# EAGLE schematic Calliope mini rev2.1 (EAGLE 9.6.2)
Assembly variants: -1

## Sheet 1 of 2
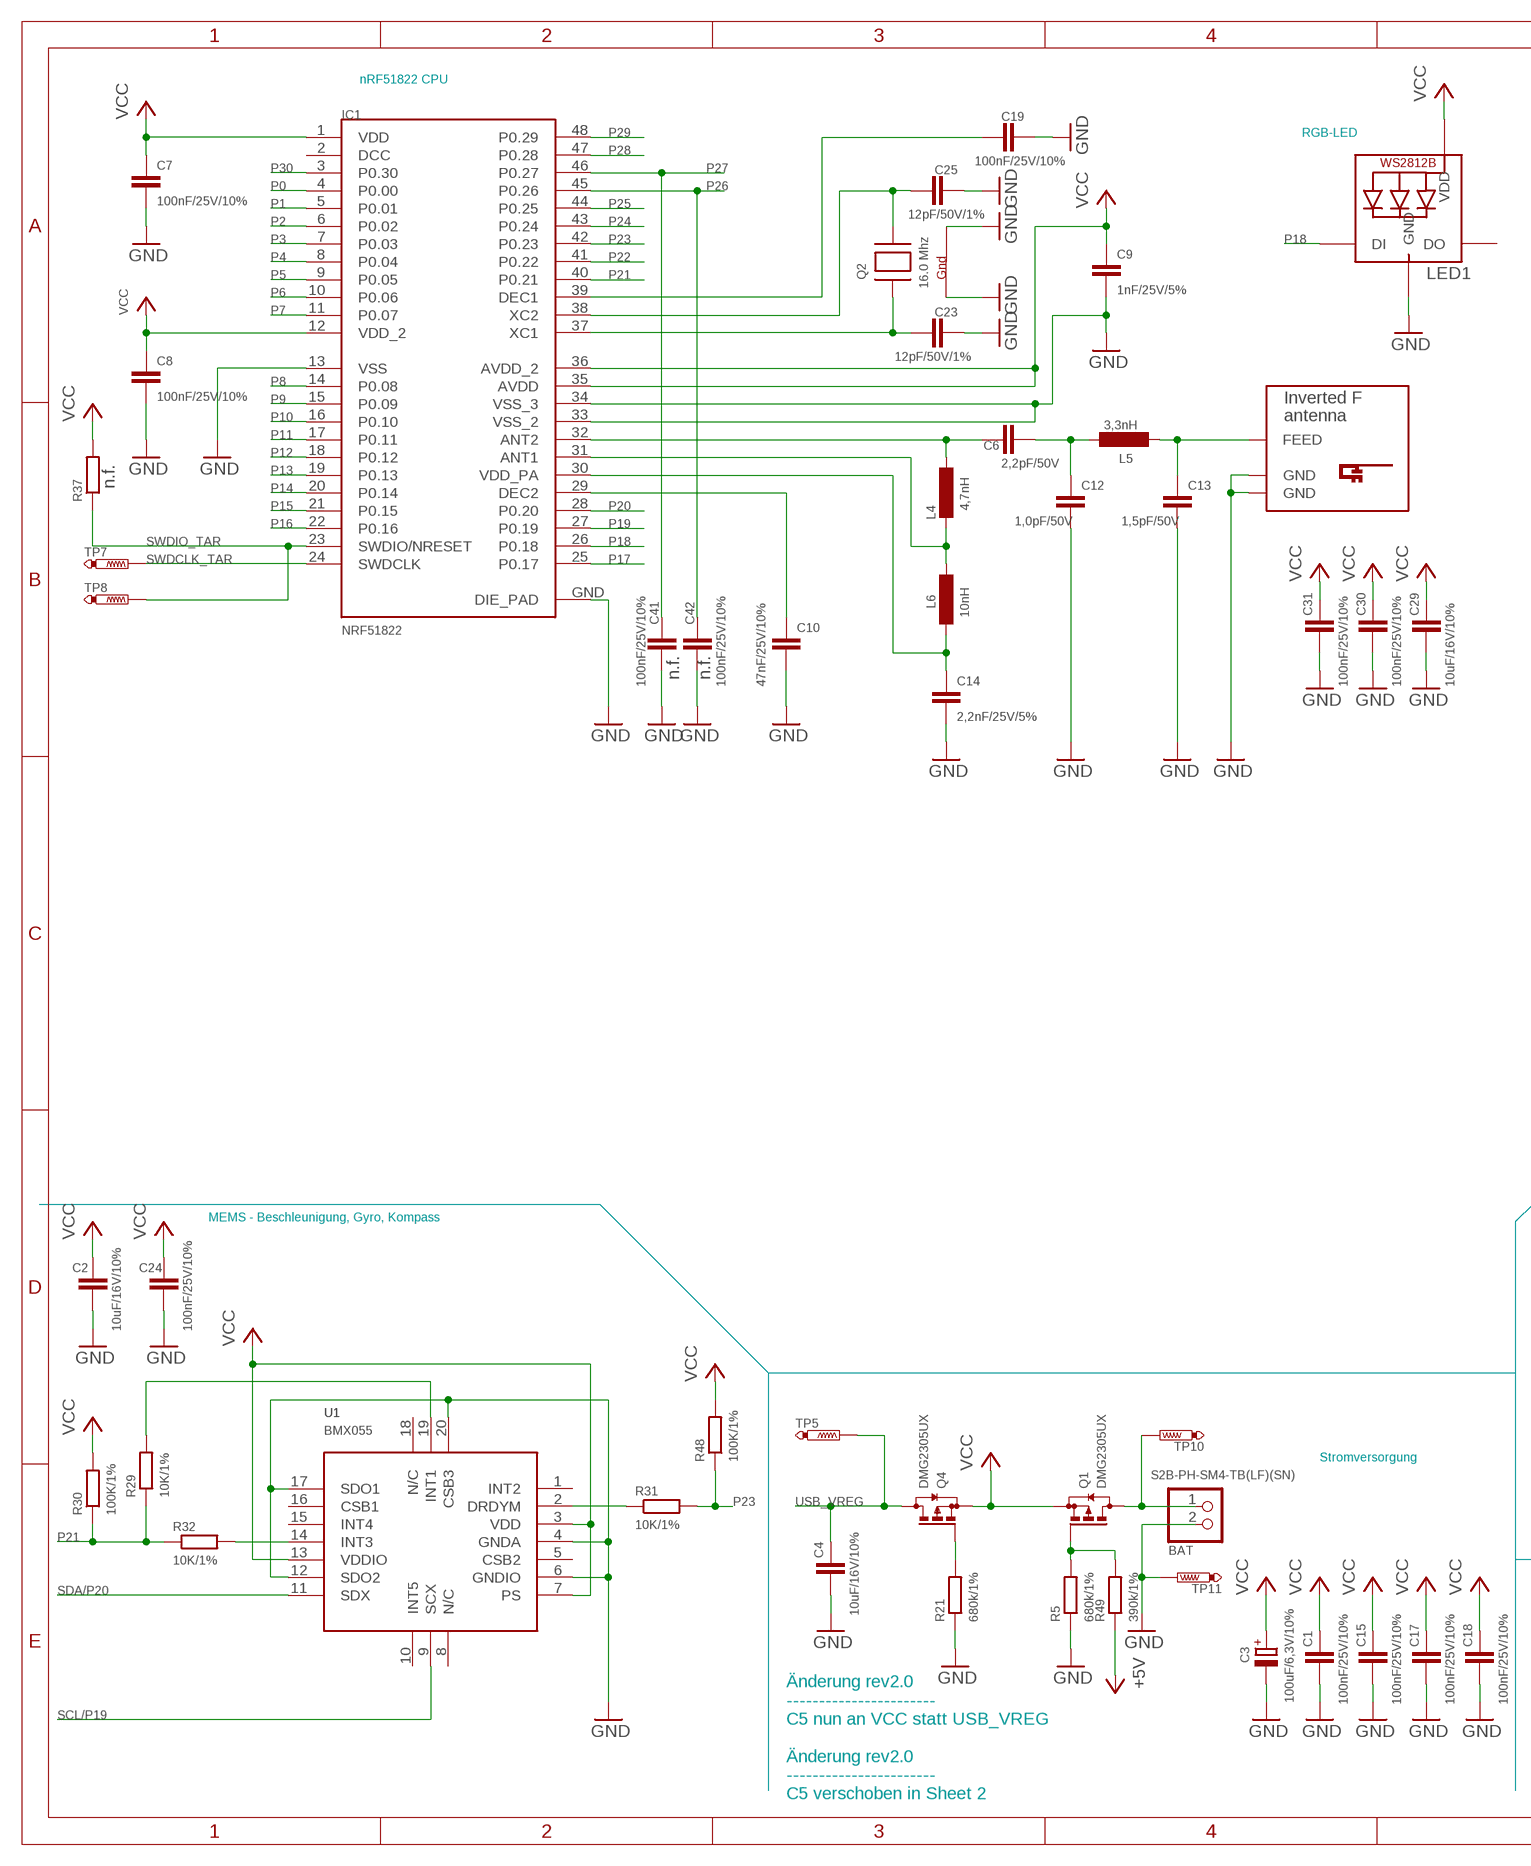
[diagram p0: schematic, sheet 1, part 1 of 2]
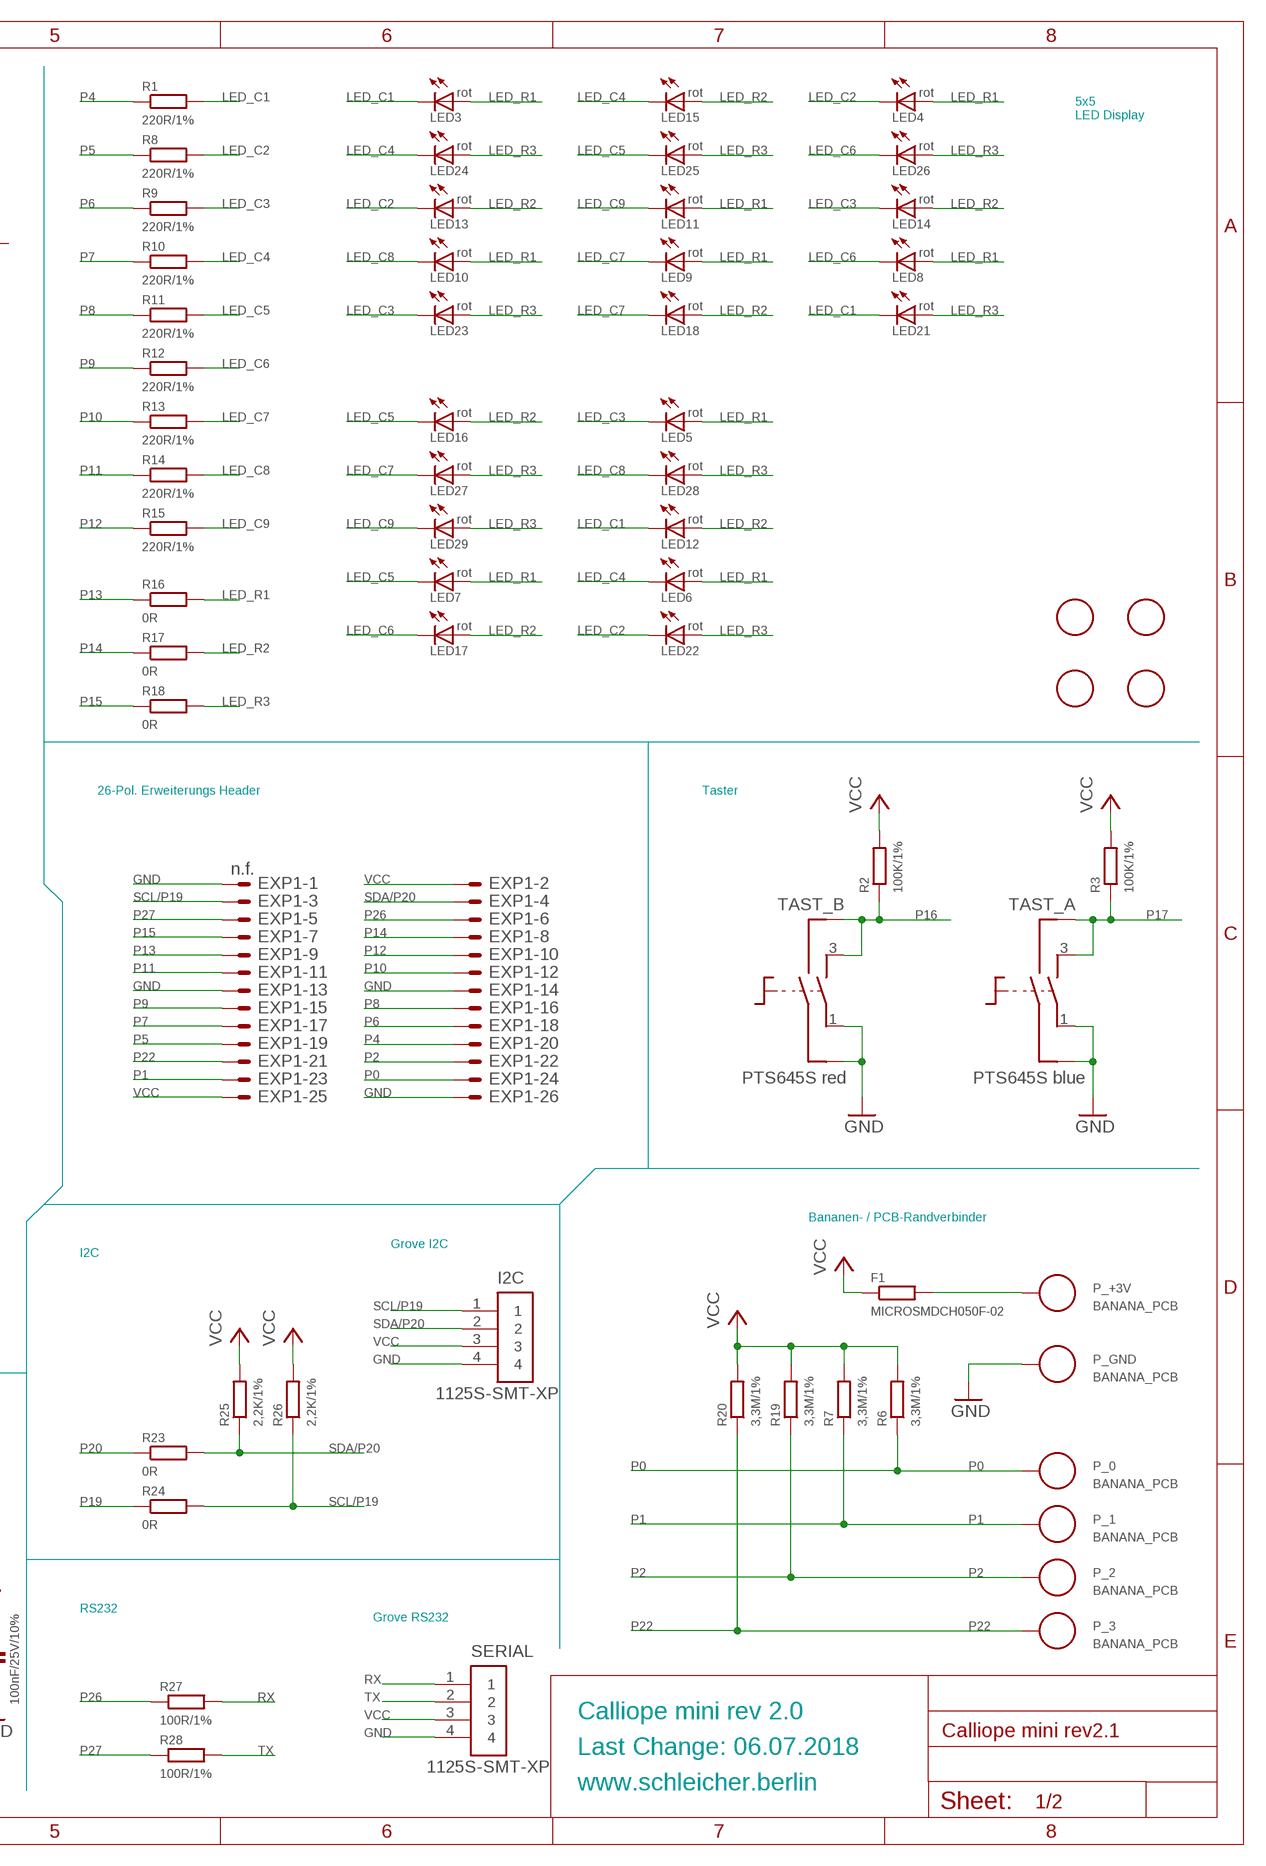
[diagram p1: schematic, sheet 1, part 2 of 2]

### Parts
BAT  S2B-PH-SM4-TB(LF)(SN)  JST_2PIN-SMT-RA  [JST-PH-2-SMT-RA]
C1  100nF/25V/10%  C-EU0402  [0402]
C2  10uF/16V/10%  C-EU0402  [0402]
C3  100uF/6,3V/10%  CPOL-EUD/7343-31R  [D/7343-31R]
C4  10uF/16V/10%  C-EU0402  [0402]
C6  2,2pF/50V  C-EU0402  [0402]
C7  100nF/25V/10%  C-EU0402  [0402]
C8  100nF/25V/10%  C-EU0402  [0402]
C9  1nF/25V/5%  C-EU0402  [0402]
C10  47nF/25V/10%  C-EU0402  [0402]
C12  1,0pF/50V  C-EU0402  [0402]
C13  1,5pF/50V  C-EU0402  [0402]
C14  2,2nF/25V/5%  C-EU0402  [0402]
C15  100nF/25V/10%  C-EU0402  [0402]
C17  100nF/25V/10%  C-EU0402  [0402]
C18  100nF/25V/10%  C-EU0402  [0402]
C19  100nF/25V/10%  C-EU0402  [0402]
C23  12pF/50V/1%  C-EU0402  [0402]
C24  100nF/25V/10%  C-EU0402  [0402]
C25  12pF/50V/1%  C-EU0402  [0402]
C29  10uF/16V/10%  C-EU0402  [0402]
C30  100nF/25V/10%  C-EU0402  [0402]
C31  100nF/25V/10%  C-EU0402  [0402]
C41  100nF/25V/10%  C-EU0402  [0402]  (not fitted in variant -1)
C42  100nF/25V/10%  C-EU0402  [0402]  (not fitted in variant -1)
EXP1  ML26E  [ML26]  (not fitted in variant -1)
F1  MICROSMDCH050F-02  R-EU_R1210  [R1210]
I2C  1125S-SMT-XP  [1125S-SMT-XP]
IC1  NRF51822  [QFN48]
L4  4,7nH  L-EU0402  [0402]
L5  3,3nH  L-EU0402  [0402]
L6  10nH  L-EU0402  [0402]
LED1  SK6812MINI  WS2812B3535  [LED3535]
LED3  rot  LEDCHIPLED_0603  [CHIPLED_0603]
LED4  rot  LEDCHIPLED_0603  [CHIPLED_0603]
LED5  rot  LEDCHIPLED_0603  [CHIPLED_0603]
LED6  rot  LEDCHIPLED_0603  [CHIPLED_0603]
LED7  rot  LEDCHIPLED_0603  [CHIPLED_0603]
LED8  rot  LEDCHIPLED_0603  [CHIPLED_0603]
LED9  rot  LEDCHIPLED_0603  [CHIPLED_0603]
LED10  rot  LEDCHIPLED_0603  [CHIPLED_0603]
LED11  rot  LEDCHIPLED_0603  [CHIPLED_0603]
LED12  rot  LEDCHIPLED_0603  [CHIPLED_0603]
LED13  rot  LEDCHIPLED_0603  [CHIPLED_0603]
LED14  rot  LEDCHIPLED_0603  [CHIPLED_0603]
LED15  rot  LEDCHIPLED_0603  [CHIPLED_0603]
LED16  rot  LEDCHIPLED_0603  [CHIPLED_0603]
LED17  rot  LEDCHIPLED_0603  [CHIPLED_0603]
LED18  rot  LEDCHIPLED_0603  [CHIPLED_0603]
LED21  rot  LEDCHIPLED_0603  [CHIPLED_0603]
LED22  rot  LEDCHIPLED_0603  [CHIPLED_0603]
LED23  rot  LEDCHIPLED_0603  [CHIPLED_0603]
LED24  rot  LEDCHIPLED_0603  [CHIPLED_0603]
LED25  rot  LEDCHIPLED_0603  [CHIPLED_0603]
LED26  rot  LEDCHIPLED_0603  [CHIPLED_0603]
LED27  rot  LEDCHIPLED_0603  [CHIPLED_0603]
LED28  rot  LEDCHIPLED_0603  [CHIPLED_0603]
LED29  rot  LEDCHIPLED_0603  [CHIPLED_0603]
P_0  BANANA_PCB  [BANANA_REC]  (not fitted in variant -1)
P_1  BANANA_PCB  [BANANA_REC]  (not fitted in variant -1)
P_2  BANANA_PCB  [BANANA_REC]  (not fitted in variant -1)
P_3  BANANA_PCB  [BANANA_REC]  (not fitted in variant -1)
P_+3V  BANANA_PCB  [BANANA_REC]  (not fitted in variant -1)
P_GND  BANANA_PCB  [BANANA_REC]  (not fitted in variant -1)
Q1  DMG2305UX  BSS84  [SOT23]
Q2  16.0 Mhz  XTAL-4-3225  [NX3225]
Q4  DMG2305UX  BSS84  [SOT23]
R1  220R/1%  R-EU_0402  [0402]
R2  100K/1%  R-EU_0402  [0402]
R3  100K/1%  R-EU_0402  [0402]
R5  680k/1%  R-EU_0402  [0402]
R6  3,3M/1%  R-EU_0402  [0402]
R7  3,3M/1%  R-EU_0402  [0402]
R8  220R/1%  R-EU_0402  [0402]
R9  220R/1%  R-EU_0402  [0402]
R10  220R/1%  R-EU_0402  [0402]
R11  220R/1%  R-EU_0402  [0402]
R12  220R/1%  R-EU_0402  [0402]
R13  220R/1%  R-EU_0402  [0402]
R14  220R/1%  R-EU_0402  [0402]
R15  220R/1%  R-EU_0402  [0402]
R16  0R  R-EU_0402  [0402]
R17  0R  R-EU_0402  [0402]
R18  0R  R-EU_0402  [0402]
R19  3,3M/1%  R-EU_0402  [0402]
R20  3,3M/1%  R-EU_0402  [0402]
R21  680k/1%  R-EU_0402  [0402]
R23  0R  R-EU_0402  [0402]
R24  0R  R-EU_0402  [0402]
R25  2,2K/1%  R-EU_0402  [0402]
R26  2,2K/1%  R-EU_0402  [0402]
R27  100R/1%  R-EU_0402  [0402]
R28  100R/1%  R-EU_0402  [0402]
R29  10K/1%  R-EU_0402  [0402]
R30  100K/1%  R-EU_0402  [0402]
R31  10K/1%  R-EU_0402  [0402]
R32  10K/1%  R-EU_0402  [0402]
R37  R-EU_0402  [0402]  (not fitted in variant -1)
R48  100K/1%  R-EU_0402  [0402]
R49  390k/1%  R-EU_0402  [0402]
SERIAL  1125S-SMT-XP  [1125S-SMT-XP]
TAST_A  PTS645S blue  PTS645S  [PTS645S]
TAST_B  PTS645S red  PTS645S  [PTS645S]
TP5  PTR1B1,27  [B1,27]  (not fitted in variant -1)
TP7  PTR1B1,27  [B1,27]  (not fitted in variant -1)
TP8  PTR1B1,27  [B1,27]  (not fitted in variant -1)
TP10  PTR1B1,27  [B1,27]  (not fitted in variant -1)
TP11  PTR1B1,27  [B1,27]  (not fitted in variant -1)
U1  BMX055  [BMX055]
U$2  INVERTED_F_ANTENNA  [DN0007+0_MIRROR]  (not fitted in variant -1)
U$5  FIDUCIAL  [FIDUCIAL_1MM]  (not fitted in variant -1)
U$6  FIDUCIAL  [FIDUCIAL_1MM]  (not fitted in variant -1)
U$7  FIDUCIAL  [FIDUCIAL_1MM]  (not fitted in variant -1)
U$8  FIDUCIAL  [FIDUCIAL_1MM]  (not fitted in variant -1)

### Nets
+5V: R49.1 ; also sheet 2
GND: BAT.2 C1.2 C2.2 C3.- C4.2 C7.2 C8.2 C9.2 C10.2 C12.2 C13.2 C14.2 C15.2 C17.2 C18.2 C19.2 C23.2 C24.2 C25.2 C29.2 C30.2 C31.2 C41.2 C42.2 EXP1.1 EXP1.13 EXP1.14 EXP1.26 I2C.4 IC1.13(VSS) IC1.33(VSS_2) IC1.34(VSS_3) IC1.GND(DIE_PAD) LED1.4(GND) P_GND.1 Q2.2(G2) Q2.4(G1) R5.1 R21.1 SERIAL.4 TAST_A.1 TAST_A.2 TAST_B.1 TAST_B.2 TP11.TP U1.4(GNDA) U1.6(GNDIO) U1.12(SDO2) U1.17(SDO1) U1.20(CSB3) U$2.GND U$2.GND@1(GND) ; also sheet 2
LED_C1: LED3.A LED12.A LED21.A R1.2
LED_C2: LED4.A LED13.A LED22.A R8.2
LED_C3: LED5.A LED14.A LED23.A R9.2
LED_C4: LED6.A LED15.A LED24.A R10.2
LED_C5: LED7.A LED16.A LED25.A R11.2
LED_C6: LED8.A LED17.A LED26.A R12.2
LED_C7: LED9.A LED18.A LED27.A R13.2
LED_C8: LED10.A LED28.A R14.2
LED_C9: LED11.A LED29.A R15.2
LED_R1: LED3.C LED4.C LED5.C LED6.C LED7.C LED8.C LED9.C LED10.C LED11.C R16.2
LED_R2: LED12.C LED13.C LED14.C LED15.C LED16.C LED17.C LED18.C R17.2
LED_R3: LED21.C LED22.C LED23.C LED24.C LED25.C LED26.C LED27.C LED28.C LED29.C R18.2
N$2: C25.1 IC1.38(XC2) Q2.3(X2)
N$3: R29.2 U1.19(INT1)
N$6: R32.2 U1.14(INT3)
N$7: Q1.1(G) R5.2 R49.2
N$9: F1.2 P_+3V.1
N$13: C23.1 IC1.37(XC1) Q2.1(X1)
N$14: C14.1 IC1.30(VDD_PA) L6.1
N$15: C6.1 IC1.32(ANT2) L4.1
N$16: C6.2 C12.1 L5.1
N$17: C13.1 L5.2 U$2.FEED
N$18: IC1.31(ANT1) L4.2 L6.2
N$19: C19.1 IC1.39(DEC1)
N$21: Q4.1(G) R21.2
N$22: C10.1 IC1.29(DEC2)
N$23: R31.1 U1.2(DRDYM)
P0: EXP1.24 IC1.4(P0.00) P_0.1 R6.1
P1: EXP1.23 IC1.5(P0.01) P_1.1 R7.1
P2: EXP1.22 IC1.6(P0.02) P_2.1 R19.1
P3: IC1.7(P0.03) ; also sheet 2
P4: EXP1.20 IC1.8(P0.04) R1.1
P5: EXP1.19 IC1.9(P0.05) R8.1
P6: EXP1.18 IC1.10(P0.06) R9.1
P7: EXP1.17 IC1.11(P0.07) R10.1
P8: EXP1.16 IC1.14(P0.08) R11.1
P9: EXP1.15 IC1.15(P0.09) R12.1
P10: EXP1.12 IC1.16(P0.10) R13.1
P11: EXP1.11 IC1.17(P0.11) R14.1
P12: EXP1.10 IC1.18(P0.12) R15.1
P13: EXP1.9 IC1.19(P0.13) R16.1
P14: EXP1.8 IC1.20(P0.14) R17.1
P15: EXP1.7 IC1.21(P0.15) R18.1
P16: IC1.22(P0.16) R2.1 TAST_B.3(S1) TAST_B.4(S2)
P17: IC1.25(P0.17) R3.1 TAST_A.3(S1) TAST_A.4(S2)
P18: IC1.26(P0.18) LED1.1(DI)
P19: IC1.27(P0.19) R24.1
P20: IC1.28(P0.20) R23.1
P21: IC1.40(P0.21) R29.1 R30.1 R32.1
P22: EXP1.21 IC1.41(P0.22) P_3.1 R20.1
P23: IC1.42(P0.23) R31.2 R48.1
P24: IC1.43(P0.24) ; also sheet 2
P25: IC1.44(P0.25) ; also sheet 2
P26: C42.1 EXP1.6 IC1.45(P0.26) R27.1
P27: C41.1 EXP1.5 IC1.46(P0.27) R28.1
P28: IC1.47(P0.28) ; also sheet 2
P29: IC1.48(P0.29) ; also sheet 2
P30: IC1.3(P0.30) ; also sheet 2
RX: R27.2 SERIAL.1
SCL/P19: EXP1.3 I2C.1 R24.2 R26.1 U1.9(SCX)
SDA/P20: EXP1.4 I2C.2 R23.2 R25.1 U1.11(SDX)
SWDCLK_TAR: IC1.24(SWDCLK) TP7.TP ; also sheet 2
SWDIO_TAR: IC1.23(SWDIO/NRESET) R37.1 TP8.TP ; also sheet 2
TX: R28.2 SERIAL.2
USB_VREG: C4.1 Q4.3(D) TP5.TP ; also sheet 2
VCC: C1.1 C2.1 C3.+ C7.1 C8.1 C9.1 C15.1 C17.1 C18.1 C24.1 C29.1 C30.1 C31.1 EXP1.2 EXP1.25 F1.1 I2C.3 IC1.1(VDD) IC1.12(VDD_2) IC1.35(AVDD) IC1.36(AVDD_2) LED1.2(VDD) Q1.2(S) Q4.2(S) R2.2 R3.2 R6.2 R7.2 R19.2 R20.2 R25.2 R26.2 R30.2 R37.2 R48.2 SERIAL.3 U1.3(VDD) U1.7(PS) U1.13(VDDIO) ; also sheet 2
VIN: BAT.1 Q1.3(D) TP10.TP
Unconnected: IC1.2(DCC) LED1.3(DO) U1.1(INT2) U1.5(CSB2) U1.8(N/C) U1.10(INT5) U1.15(INT4) U1.16(CSB1) U1.18(N/C)

### Notes on the sheet
- nRF51822 CPU
- 5x5
  LED Display
- RGB-LED
- LED1
- 26-Pol. Erweiterungs Header | Taster
- MEMS - Beschleunigung, Gyro, Kompass | Bananen- / PCB-Randverbinder
- Grove I2C
- I2C
- Stromversorgung
- RS232
- Grove RS232
- Calliope mini rev 2.0
- Last Change: 06.07.2018
- www.schleicher.berlin
- Änderung rev2.0
  -----------------------
  C5 nun an VCC statt USB_VREG
  
  Änderung rev2.0
  -----------------------
  C5 verschoben in Sheet 2

## Sheet 2 of 2
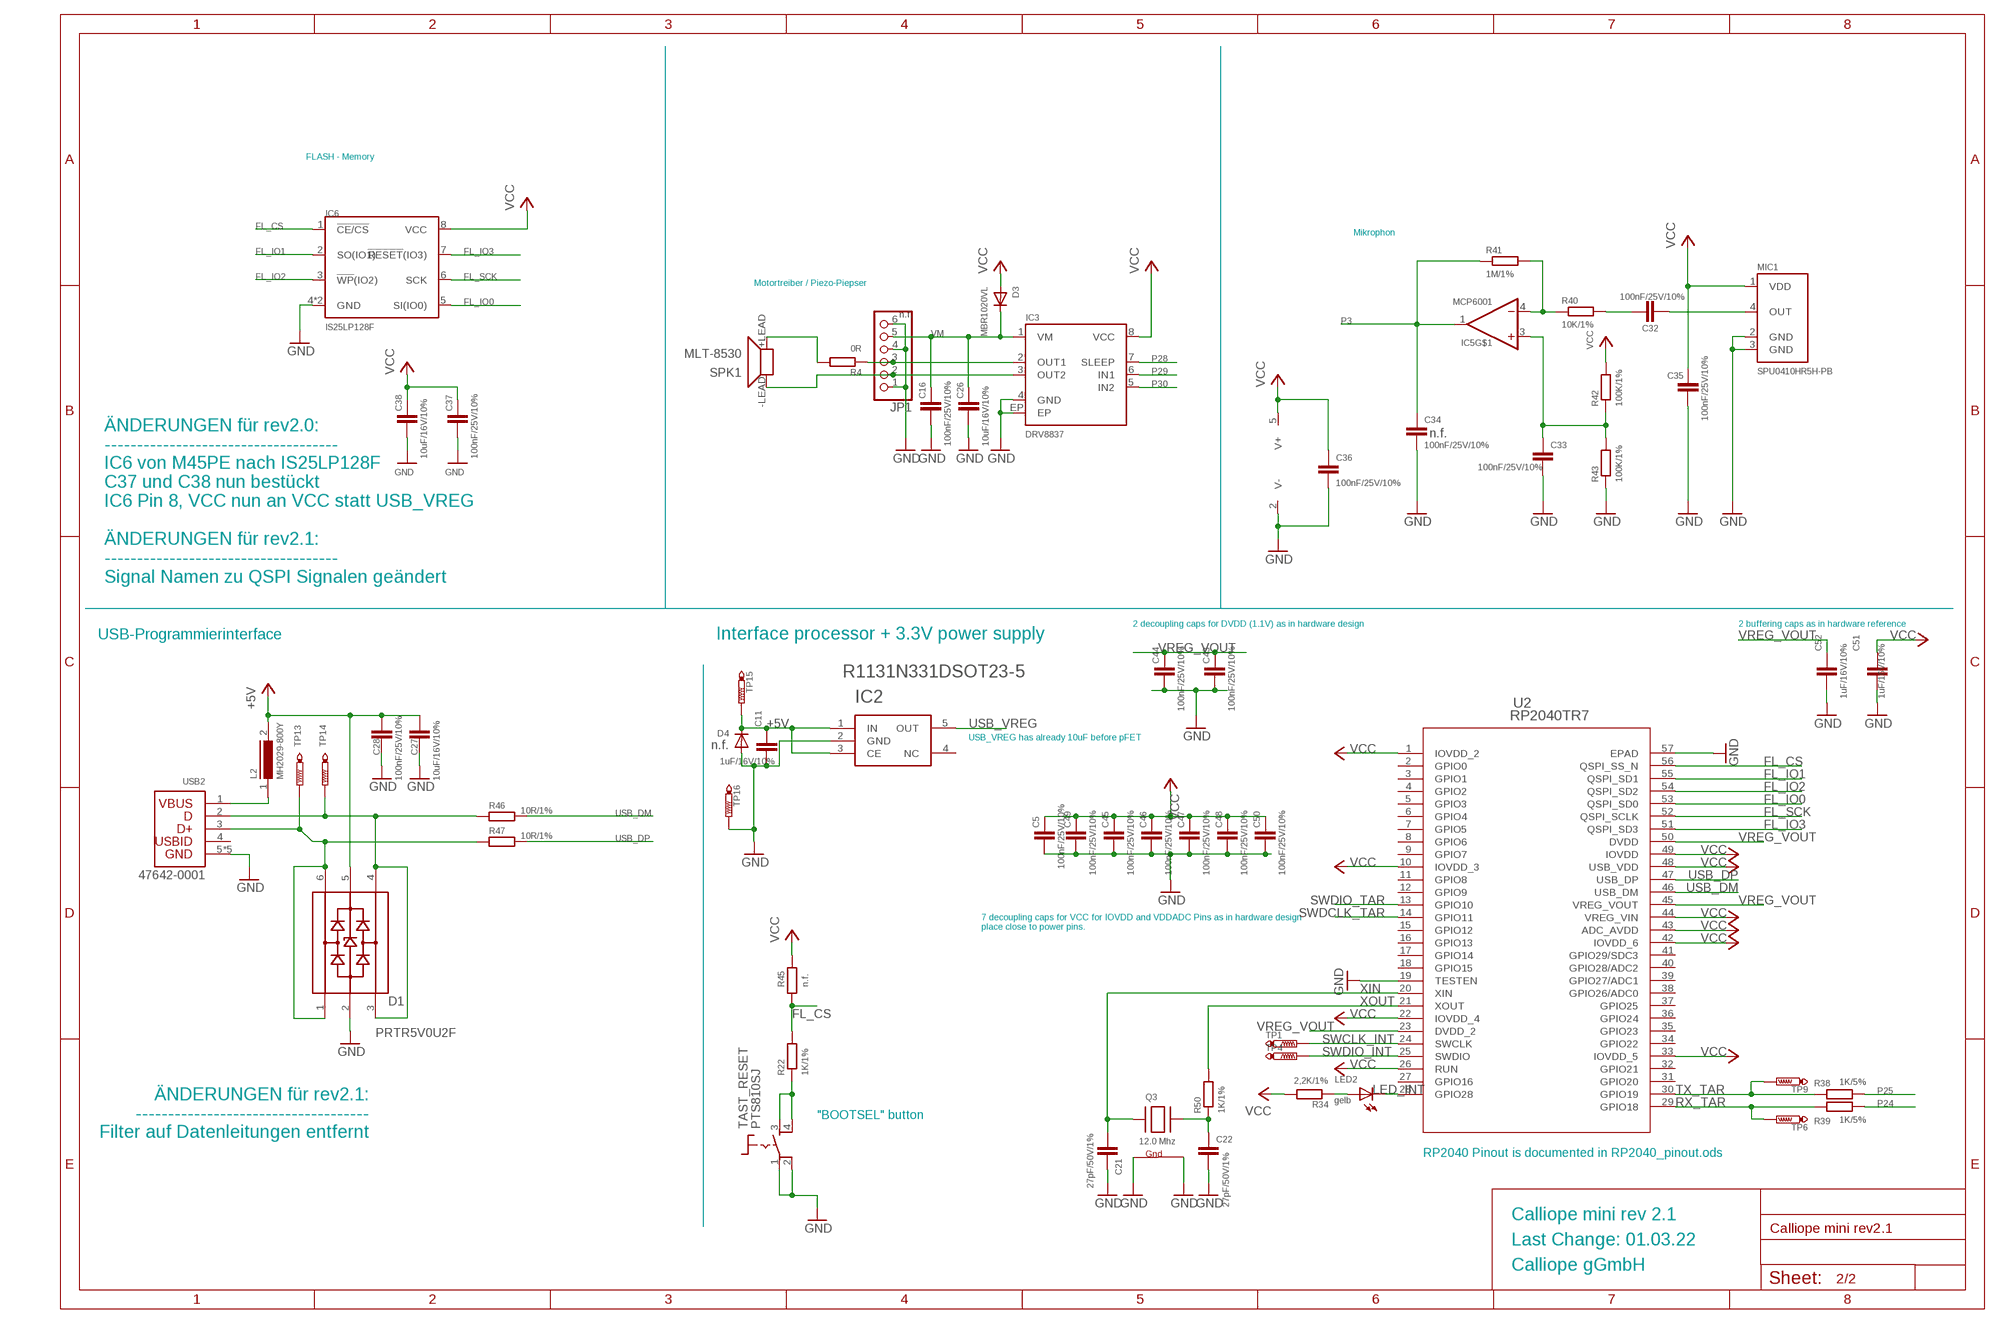
[diagram p2: schematic, sheet 2]

### Parts
C5  100nF/25V/10%  C-EU0402  [0402]
C11  1uF/16V/10%  C-EU0402  [0402]  (not fitted in variant -1)
C16  100nF/25V/10%  C-EU0402  [0402]
C21  27pF/50V/1%  C-EU0402  [0402]
C22  27pF/50V/1%  C-EU0402  [0402]
C26  10uF/16V/10%  C-EU0402  [0402]
C27  10uF/16V/10%  C-EU0402  [0402]
C28  100nF/25V/10%  C-EU0402  [0402]
C32  100nF/25V/10%  C-EU0402  [0402]
C33  100nF/25V/10%  C-EU0402  [0402]
C34  100nF/25V/10%  C-EU0402  [0402]  (not fitted in variant -1)
C35  100nF/25V/10%  C-EU0402  [0402]
C36  100nF/25V/10%  C-EU0402  [0402]
C37  100nF/25V/10%  C-EU0402  [0402]  (not fitted in variant -1)
C38  10uF/16V/10%  C-EU0402  [0402]  (not fitted in variant -1)
C43  100nF/25V/10%  C-EU0402  [0402]  (not fitted in variant -1)
C44  100nF/25V/10%  C-EU0402  [0402]  (not fitted in variant -1)
C45  100nF/25V/10%  C-EU0402  [0402]  (not fitted in variant -1)
C46  100nF/25V/10%  C-EU0402  [0402]  (not fitted in variant -1)
C47  100nF/25V/10%  C-EU0402  [0402]  (not fitted in variant -1)
C48  100nF/25V/10%  C-EU0402  [0402]  (not fitted in variant -1)
C49  100nF/25V/10%  C-EU0402  [0402]  (not fitted in variant -1)
C50  100nF/25V/10%  C-EU0402  [0402]  (not fitted in variant -1)
C51  1uF/16V/10%  C-EU0402  [0402]  (not fitted in variant -1)
C52  1uF/16V/10%  C-EU0402  [0402]  (not fitted in variant -1)
D1  PRTR5V0U2F  [SOT886]
D3  MBR1020VL  DIODE_SOD-123FL  [SOD-123FL]
D4  DIODE-SOD323-R  [SOD323-R]  (not fitted in variant -1)
IC2  R1131N331DSOT23-5  [SOT23-5]
IC3  DRV8837  [WSON8]
IC5  MCP6001  OPAMP_SINGLESOT23-5  [SOT23-5]
IC6  IS25LP128F  [VQFN8_6X5]
JP1  PINHD-1X6-OFF  [1X06-OFF]
L2  MH2029-800Y  [FERRIT_0805]
LED2  gelb  LEDCHIPLED_0603  [CHIPLED_0603]
MIC1  SPU0410HR5H-PB  [SPU0410HR5H-PB]
Q3  12.0 Mhz  XTAL-4-3225  [NX3225]
R4  0R  R-EU_0402  [0402]
R22  1K/1%  R-EU_0402  [0402]
R34  2,2K/1%  R-EU_0402  [0402]
R38  1K/5%  R-EU_0402  [0402]
R39  1K/5%  R-EU_0402  [0402]
R40  10K/1%  R-EU_0402  [0402]
R41  1M/1%  R-EU_0402  [0402]
R42  100K/1%  R-EU_0402  [0402]
R43  100K/1%  R-EU_0402  [0402]
R45  n.f.  R-EU_0402  [0402]
R46  10R/1%  R-EU_R0402  [R0402]
R47  10R/1%  R-EU_R0402  [R0402]
R50  1K/1%  R-EU_0402  [0402]
SPK1  MLT-8530  [MLT-8530]
TAST_RESET  PTS810SJ  [PTS810]
TP1  PTR1B1,27  [B1,27]  (not fitted in variant -1)
TP4  PTR1B1,27  [B1,27]  (not fitted in variant -1)
TP6  PTR1B1,27  [B1,27]  (not fitted in variant -1)
TP9  PTR1B1,27  [B1,27]  (not fitted in variant -1)
TP13  PTR1B1,27  [B1,27]  (not fitted in variant -1)
TP14  PTR1B1,27  [B1,27]  (not fitted in variant -1)
TP15  PTR1B1,27  [B1,27]  (not fitted in variant -1)
TP16  PTR1B1,27  [B1,27]  (not fitted in variant -1)
U2  RP2040TR7  [RP2040TR7_RPI]
USB2  47642-0001  [47642-0001]

### Nets
+5V: C11.1 C27.1 C28.1 D1.5 D4.C IC2.1(IN) IC2.3(CE) L2.2 TP15.TP ; also sheet 1
FL_CS: IC6.1(!CE/CS) R22.2 R45.1 U2.56(QSPI_SS_N)
FL_IO0: IC6.5(SI(IO0)) U2.53(QSPI_SD0)
FL_IO1: IC6.2(SO(IO1)) U2.55(QSPI_SD1)
FL_IO2: IC6.3(!WP!(IO2)) U2.54(QSPI_SD2)
FL_IO3: IC6.7(!RESET!(IO3)) U2.51(QSPI_SD3)
FL_SCK: IC6.6(SCK) U2.52(QSPI_SCLK)
GND: C5.2 C11.2 C16.2 C21.2 C22.2 C26.2 C27.2 C28.2 C33.2 C34.2 C35.2 C36.2 C37.2 C38.2 C43.2 C44.2 C45.2 C46.2 C47.2 C48.2 C49.2 C50.2 C51.2 C52.2 D1.2 D4.A IC2.2(GND) IC3.4(GND) IC3.EP IC5.2(V-) IC6.4(GND) IC6.EP(GND) JP1.1 JP1.4 JP1.6 MIC1.2(GND) MIC1.3(GND) Q3.2(G2) Q3.4(G1) R43.1 TAST_RESET.1(P) TAST_RESET.2(P1) TP16.TP U2.19(TESTEN) U2.57(EPAD) USB2.5 USB2.P$1 USB2.P$2 USB2.P$3 USB2.P$4 ; also sheet 1
LED_INT: LED2.A U2.28(GPIO28)
N$1: IC3.3(OUT2) JP1.2 SPK1.-LEAD
N$8: LED2.C R34.1
N$10: IC3.2(OUT1) JP1.3 R4.1
N$11: C22.1 Q3.3(X2) R50.1
N$12: R4.2 SPK1.+LEAD
N$24: C33.1 IC5.3(+IN) R42.1 R43.2
N$25: L2.1 USB2.1
N$26: D1.1 D1.6 R47.1 TP13.TP USB2.3
N$28: D1.3 D1.4 R46.1 TP14.TP USB2.2
N$29: IC5.4(-IN) R40.1 R41.2
N$30: C32.1 R40.2
N$31: C32.2 MIC1.4(OUT)
P3: C34.1 IC5.1(OUT) R41.1 ; also sheet 1
P24: R39.2 ; also sheet 1
P25: R38.2 ; also sheet 1
P28: IC3.7(SLEEP) ; also sheet 1
P29: IC3.6(IN1) ; also sheet 1
P30: IC3.5(IN2) ; also sheet 1
RESET_SW: R22.1 TAST_RESET.3(S) TAST_RESET.4(S1)
RX_TAR: R39.1 TP6.TP U2.29(GPIO18)
SWCLK_INT: TP1.TP U2.24(SWCLK)
SWDCLK_TAR: U2.14(GPIO11) ; also sheet 1
SWDIO_INT: TP4.TP U2.25(SWDIO)
SWDIO_TAR: U2.13(GPIO10) ; also sheet 1
TX_TAR: R38.1 TP9.TP U2.30(GPIO19)
USB_DM: R46.2 U2.46(USB_DM)
USB_DP: R47.2 U2.47(USB_DP)
USB_VREG: IC2.5(OUT) ; also sheet 1
VCC: C5.1 C35.1 C36.1 C37.1 C38.1 C45.1 C46.1 C47.1 C48.1 C49.1 C50.1 C51.1 D3.A IC3.8(VCC) IC5.5(V+) IC6.8(VCC) MIC1.1(VDD) R34.2 R42.2 R45.2 U2.1(IOVDD_2) U2.10(IOVDD_3) U2.22(IOVDD_4) U2.26(RUN) U2.33(IOVDD_5) U2.42(IOVDD_6) U2.43(ADC_AVDD) U2.44(VREG_VIN) U2.48(USB_VDD) U2.49(IOVDD) ; also sheet 1
VM: C16.1 C26.1 D3.C IC3.1(VM) JP1.5
VREG_VOUT: C43.1 C44.1 C52.1 U2.23(DVDD_2) U2.45(VREG_VOUT) U2.50(DVDD)
XIN: C21.1 Q3.1(X1) U2.20(XIN)
XOUT: R50.2 U2.21(XOUT)
Unconnected: IC2.4(NC) U2.2(GPIO0) U2.3(GPIO1) U2.4(GPIO2) U2.5(GPIO3) U2.6(GPIO4) U2.7(GPIO5) U2.8(GPIO6) U2.9(GPIO7) U2.11(GPIO8) U2.12(GPIO9) U2.15(GPIO12) U2.16(GPIO13) U2.17(GPIO14) U2.18(GPIO15) U2.27(GPIO16) U2.31(GPIO20) U2.32(GPIO21) U2.34(GPIO22) U2.35(GPIO23) U2.36(GPIO24) U2.37(GPIO25) U2.38(GPIO26/ADC0) U2.39(GPIO27/ADC1) U2.40(GPIO28/ADC2) U2.41(GPIO29/SDC3) USB2.4

### Notes on the sheet
- FLASH - Memory
- Mikrophon
- Motortreiber / Piezo-Piepser
- n.f.
- ÄNDERUNGEN für rev2.0:
  ------------------------------------
  IC6 von M45PE nach IS25LP128F
  C37 und C38 nun bestückt
  IC6 Pin 8, VCC nun an VCC statt USB_VREG
  
  ÄNDERUNGEN für rev2.1:
  ------------------------------------
  Signal Namen zu QSPI Signalen geändert
- 2 decoupling caps for DVDD (1.1V) as in hardware design | 2 buffering caps as in hardware reference
- USB-Programmierinterface | Interface processor + 3.3V power supply
- USB_VREG has already 10uF before pFET
- 7 decoupling caps for VCC for IOVDD and VDDADC Pins as in hardware design
  place close to power pins.
- "BOOTSEL" button
- ÄNDERUNGEN für rev2.1:
  ------------------------------------
  Filter auf Datenleitungen entfernt
- RP2040 Pinout is documented in RP2040_pinout.ods
- Calliope mini rev 2.1
- Last Change: 01.03.22
- Calliope gGmbH

## Library data of the parts
BAT = adafruit:JST_2PIN: JST 2-Pin Connectors of various flavors SMT-RA (S2B-PH-SM4) 4UConnector #17311 SMT (B2B-PH-SM4) THM-RA (S2B-PH) THM (B2B-PH)
C1 C5 C7 C8 C10 C15-C19 C24 C28 C30-C33 C35-C37 C43-C50 = rcl:C-EU: CAPACITOR, European symbol; ARTICLE_NUMBER_SCHLEICHER: RC.067.0150.0
C2 C4 C6 C9 C11-C14 C21-C23 C25-C27 C29 C38 C51 C52 = rcl:C-EU: CAPACITOR, European symbol
C3 = resistor:CPOL-EU: POLARIZED CAPACITOR, European symbol
C34 C41 C42 = rcl:C-EU: CAPACITOR, European symbol; ARTICLE_NUMBER_SCHLEICHER: RC.067.0150.0; MOUNTING: n.f.
D1 = diode:PRTR5V0U2*: Ultra low capacitance double rail-to-rail ESD protection; REVERSE_VOLTAGE: 5.5V
D3 = adafruit:DIODE: Diode SMADIODE - SMA Surface Mount Package 20V 1A Schottky Diode Digikey: 641-1014-6-ND DO-1N4148 - Through Hole Small Current Diode SOD-123 20V 1 A (.5mV Vf) Schottky Diode - Digikey: MBRX120TPMSCT-ND SOD-323 10V 570mA (.38mV Vf, 3ns) Schottky Diode - Digikey: ZLLS410CT-ND SOD-523 30V 30mA Schottky Diode (RB751S-40TE61) - Digikey: RB751S-40TE61CT-ND SOT23-R/W - SOT23 Package (R = Solder Paste/Reflow Ovens, W = Hand-Soldering) BAT54Film 40V 300mA - Digikey: 497-7162-1-ND
D4 = diode:DIODE-: DIODE; MOUNTING: n.f.
EXP1 = con-harting-ml:ML26?E: HARTING; MOUNTING: n.f.; OC_FARNELL: unknown; OC_NEWARK: unknown
F1 R1-R21 R23-R28 R30 R34 R38 R39 R42 R43 R48 R49 = rcl:R-EU_: RESISTOR, European symbol
I2C SERIAL = Calliope:1125*-SMT-XP
IC1 = NordicSemi:NRF51822: Bluetooth 4.0 Low Energy/2.4Ghz NORDIC SEMICONDUCTOR; VALUE2: NRF51822-QFAA-R7
IC2 = update:R1131N331D
IC3 = Bjorn4:DRV8837
IC5 = Bjorn4:OPAMP_SINGLE
IC6 = update:IS25LP128F
JP1 = Calliope:PINHD-1X6-OFF: PIN HEADER
L2 = inductors:MH2029-*Y: Ferrit 80R 0805 Bourns; ARTICLE_NUMBER_SCHLEICHER: RT.024.2301.0; CURRENT: 3A; DCR: 40R; IMPEDANCE: 80R; TOLERANCE: +-25%
L4 = rcl:L-EU: INDUCTOR, European symbol; VALUE2: LQW15AN4N7B00D
L5 = rcl:L-EU: INDUCTOR, European symbol; VALUE2: LQW15AN3N3B80D
L6 = rcl:L-EU: INDUCTOR, European symbol; VALUE2: LQW15AN10NG00D
LED1 = adafruit:WS2812B
LED2 = led:LED: LED OSRAM: - CHIPLED LG R971, LG N971, LY N971, LG Q971, LY Q971, LO R971, LY R971 LH N974, LH R974 LS Q976, LO Q976, LY Q976 LO Q996 - Hyper CHIPLED LW Q18S LB Q993, LB Q99A, LB R99A - SideLED LS A670, LO A670, LY A670, LG A670, LP A670 LB A673, LV A673, LT A673, LW A673 LH A674 LY A675 LS A676, LA A676, LO A676, LY A676, LW A676 LS A679, LY A679, LG A679 - Hyper Micro SIDELED® LS Y876, LA Y876, LO Y876, LY Y876 LT Y87S - SmartLED LW L88C, LW L88S LB L89C, LB L89S, LG L890 LS L89K, LO L89K, LY L89K LS L896, LA L896, LO L896, LY L896 - TOPLED LS T670, LO T670, LY T670, LG T670, LP T670 LSG T670, LSP T670, LSY T670, LOP T670, LYG T670 LG T671, LOG T671, LSG T671 LB T673, LV T673, LT T673, LW T673 LH T674 LS T676, LA T676, LO T676, LY T676, LB T676, LH T676, LSB T676, LW T676 LB T67C, LV T67C, LT T67C, LS T67K, LO T67K, LY T67K, LW E67C LS E67B, LA E67B, LO E67B, LY E67B, LB E67C, LV E67C, LT E67C LW T67C LS T679, LY T679, LG T679 LS T770, LO T770, LY T770, LG T770, LP T770 LB T773, LV T773, LT T773, LW T773 LH T774 LS E675, LA E675, LY E675, LS T675 LS T776, LA T776, LO T776, LY T776, LB T776 LHGB T686 LT T68C, LB T68C - Hyper Mini TOPLED® LB M676 - Mini TOPLED Santana® LG M470 LS M47K, LO M47K, LY M47K Source: http://www.osram.convergy.de LUXEON: - LUMILED® LXK2-PW12-R00, LXK2-PW12-S00, LXK2-PW14-U00, LXK2-PW14-V00 LXK2-PM12-R00, LXK2-PM12-S00, LXK2-PM14-U00 LXK2-PE12-Q00, LXK2-PE12-R00, LXK2-PE12-S00, LXK2-PE14-T00, LXK2-PE14-U00 LXK2-PB12-K00, LXK2-PB12-L00, LXK2-PB12-M00, LXK2-PB14-N00, LXK2-PB14-P00, LXK2-PB14-Q00 LXK2-PR12-L00, LXK2-PR12-M00, LXK2-PR14-Q00, LXK2-PR14-R00 LXK2-PD12-Q00, LXK2-PD12-R00, LXK2-PD12-S00 LXK2-PH12-R00, LXK2-PH12-S00 LXK2-PL12-P00, LXK2-PL12-Q00, LXK2-PL12-R00 Source: www.luxeon.com KINGBRIGHT: KA-3528ASYC Source: www.kingbright.com; VALUE2: LTST-C191KSKT
LED3-LED18 LED21-LED29 = led:LED: LED OSRAM: - CHIPLED LG R971, LG N971, LY N971, LG Q971, LY Q971, LO R971, LY R971 LH N974, LH R974 LS Q976, LO Q976, LY Q976 LO Q996 - Hyper CHIPLED LW Q18S LB Q993, LB Q99A, LB R99A - SideLED LS A670, LO A670, LY A670, LG A670, LP A670 LB A673, LV A673, LT A673, LW A673 LH A674 LY A675 LS A676, LA A676, LO A676, LY A676, LW A676 LS A679, LY A679, LG A679 - Hyper Micro SIDELED® LS Y876, LA Y876, LO Y876, LY Y876 LT Y87S - SmartLED LW L88C, LW L88S LB L89C, LB L89S, LG L890 LS L89K, LO L89K, LY L89K LS L896, LA L896, LO L896, LY L896 - TOPLED LS T670, LO T670, LY T670, LG T670, LP T670 LSG T670, LSP T670, LSY T670, LOP T670, LYG T670 LG T671, LOG T671, LSG T671 LB T673, LV T673, LT T673, LW T673 LH T674 LS T676, LA T676, LO T676, LY T676, LB T676, LH T676, LSB T676, LW T676 LB T67C, LV T67C, LT T67C, LS T67K, LO T67K, LY T67K, LW E67C LS E67B, LA E67B, LO E67B, LY E67B, LB E67C, LV E67C, LT E67C LW T67C LS T679, LY T679, LG T679 LS T770, LO T770, LY T770, LG T770, LP T770 LB T773, LV T773, LT T773, LW T773 LH T774 LS E675, LA E675, LY E675, LS T675 LS T776, LA T776, LO T776, LY T776, LB T776 LHGB T686 LT T68C, LB T68C - Hyper Mini TOPLED® LB M676 - Mini TOPLED Santana® LG M470 LS M47K, LO M47K, LY M47K Source: http://www.osram.convergy.de LUXEON: - LUMILED® LXK2-PW12-R00, LXK2-PW12-S00, LXK2-PW14-U00, LXK2-PW14-V00 LXK2-PM12-R00, LXK2-PM12-S00, LXK2-PM14-U00 LXK2-PE12-Q00, LXK2-PE12-R00, LXK2-PE12-S00, LXK2-PE14-T00, LXK2-PE14-U00 LXK2-PB12-K00, LXK2-PB12-L00, LXK2-PB12-M00, LXK2-PB14-N00, LXK2-PB14-P00, LXK2-PB14-Q00 LXK2-PR12-L00, LXK2-PR12-M00, LXK2-PR14-Q00, LXK2-PR14-R00 LXK2-PD12-Q00, LXK2-PD12-R00, LXK2-PD12-S00 LXK2-PH12-R00, LXK2-PH12-S00 LXK2-PL12-P00, LXK2-PL12-Q00, LXK2-PL12-R00 Source: www.luxeon.com KINGBRIGHT: KA-3528ASYC Source: www.kingbright.com; VALUE2: LTST-C190KRKT
MIC1 = Bjorn4:SPU0410HR5H-PB
P_0 P_1-P_3 P_+3V P_GND = Bjorn4:BANANA_PCB
Q1 Q4 = transistor-small-signal:BSS84: P-CHANNEL MOS FET
Q2 = adafruit:XTAL-4: Classic 4-pin 3.2 x 2.5mm crystal; VALUE2: ABM8-16.000MHZ-7-1-U-T
Q3 = adafruit:XTAL-4: Classic 4-pin 3.2 x 2.5mm crystal; VALUE2: FL1200112
R22 R29 R31 R32 R40 R41 R45 R50 = rcl:R-EU_: RESISTOR, European symbol; ARTICLE_NUMBER_SCHLEICHER: RR.110.0097.0
R37 = rcl:R-EU_: RESISTOR, European symbol; MOUNTING: n.f.
R46 R47 = rcl:R-EU_: RESISTOR, European symbol; SPICEPREFIX: R
SPK1 = speaker_MLT-8530:MLT-8530: Speaker 8.7 x 8.7 mm, 16 Ohm
TAST_A = Bjorn4:PTS645; VALUE2: PTS645SM43SMTR92 LFS
TAST_B = Bjorn4:PTS645; VALUE2: PTS645SK43SMTR92 LFS
TAST_RESET = Bjorn4:PTS810; VALUE2: PTS810 SJK 250 SMTR LFS
TP1 TP4-TP11 TP13-TP16 = testpad:PTR1: TEST PIN
U1 = x-io:BMX055
U2 = update:RP2040TR7; COPYRIGHT: Copyright (C) 2022 Ultra Librarian. All rights reserved.; MANUFACTURER_PART_NUMBER: RP2040TR7; MFR_NAME: Raspberry Pi
U$2 = antenna:INVERTED_F_ANTENNA: 2.4GHz Inverted F Antenna Based on TI Design Note DN007
U$5-U$8 = adafruit:FIDUCIAL: For use by pick and place machines to calibrate the vision/machine, 1mm By microbuilder.eu
USB2 = Calliope:47642-0001